# Altium schematic sheet Main.SchDoc
size A; DocumentNumber: 1; SheetNumber: 1; SheetTotal: 5
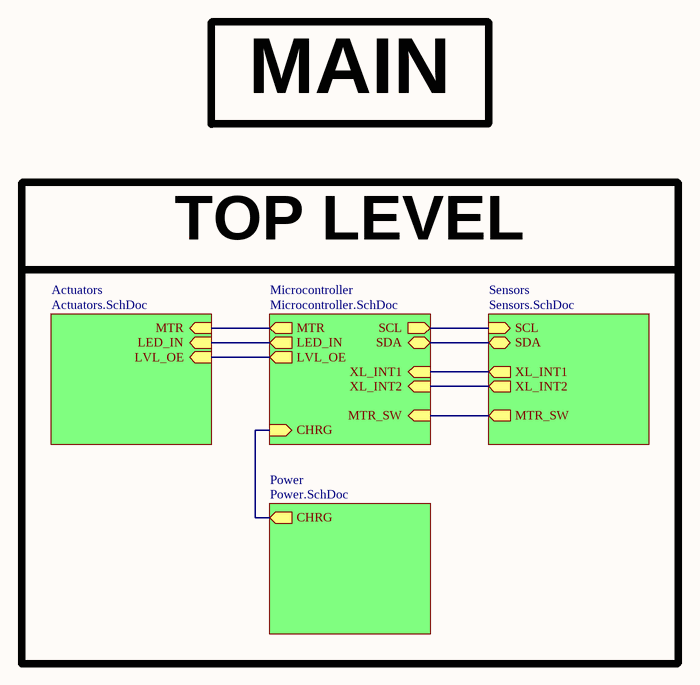
[diagram p0: Main.SchDoc]

## Parts
LOGO  SM Logo  [smLogo_10]  (value not drawn)  (no BOM)

## Sub-sheets
Actuators = Actuators.SchDoc: MTR (in), LVL_OE (in), LED_IN (in)
Microcontroller = Microcontroller.SchDoc: SCL (out), SDA, CHRG (in), MTR (out), LVL_OE (out), LED_IN (out), MTR_SW (in), XL_INT1 (in), XL_INT2 (in)
Power = Power.SchDoc: CHRG (out)
Sensors = Sensors.SchDoc: SCL (in), SDA, MTR_SW (out), XL_INT1 (out), XL_INT2 (out)

## Nets
(unnamed): sheet Microcontroller/SCL, sheet Sensors/SCL
(unnamed): sheet Microcontroller/SDA, sheet Sensors/SDA
(unnamed): sheet Microcontroller/CHRG, sheet Power/CHRG
(unnamed): sheet Microcontroller/MTR, sheet Actuators/MTR
(unnamed): sheet Microcontroller/LVL_OE, sheet Actuators/LVL_OE
(unnamed): sheet Microcontroller/LED_IN, sheet Actuators/LED_IN
(unnamed): sheet Microcontroller/MTR_SW, sheet Sensors/MTR_SW
(unnamed): sheet Microcontroller/XL_INT1, sheet Sensors/XL_INT1
(unnamed): sheet Microcontroller/XL_INT2, sheet Sensors/XL_INT2

## Notes on the sheet
- MAIN
- TOP LEVEL

## Library data of the parts
LOGO = smLogo